# Altium schematic sheet 2025-07-26_00-47-341.schdoc
size 304 x 111 mm; SheetNumber: 1; SheetTotal: 1
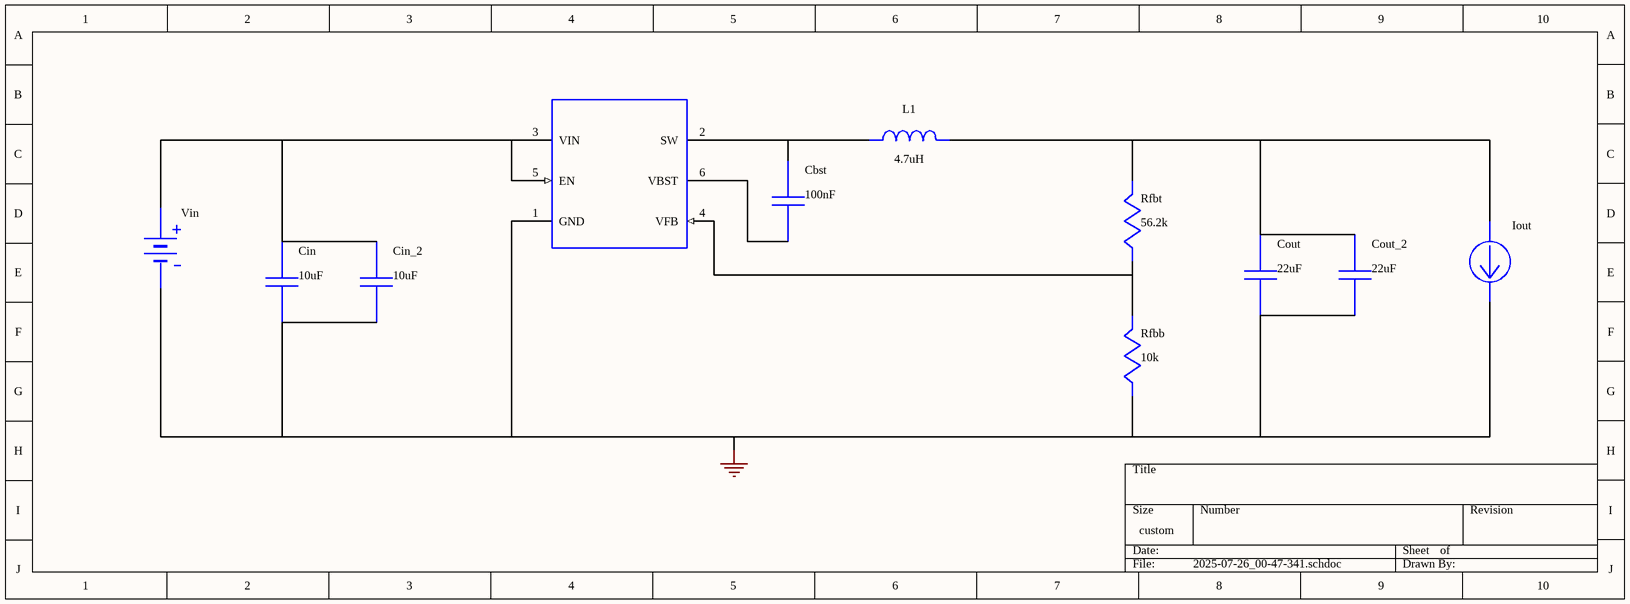
[diagram p0: 2025-07-26_00-47-341.schdoc]

## Parts
Cbst  value 100nF  (hidden comment: 08053C104KAT2A)
Cin  value 10uF  (hidden comment: MSAST219LB5106KTNA01)
Cin_2  value 10uF  (hidden comment: MSAST219LB5106KTNA01)
Cout  value 22uF  (hidden comment: C1608X5R1A226M080AC)
Cout_2  value 22uF  (hidden comment: C1608X5R1A226M080AC)
Iout  WB_CURRENT_LOAD  (value not drawn)
L1  value 4.7uH  (hidden comment: SRN6045-4R7Y)
Rfbb  value 10k  (hidden comment: RC0201FR-0710KL)
Rfbt  value 56.2k  (hidden comment: RC0201FR-0756K2L)
U1  TPS562200DDCR  (value not drawn)
Vin  WB_BATTERY  (value not drawn)

## Nets
0: Cin.2 Cin_2.2 Cout.2 Cout_2.2 Iout.2(-) Rfbb.2 U1.1(GND) Vin.2(-)
NetCbst_1: Cbst.1 L1.1 U1.2(SW)
NetCbst_2: Cbst.2 U1.6(VBST)
NetCin_1: Cin.1 Cin_2.1 U1.3(VIN) U1.5(EN) Vin.1(+)
NetCout_1: Cout.1 Cout_2.1 Iout.1(+) L1.2 Rfbt.1
NetRfbb_1: Rfbb.1 Rfbt.2 U1.4(VFB)

## Library data of the parts
Cbst = 08053C104KAT2A: Manufacturer Name: AVX; PackageReference: 08053C104KAT2A; Manufacturer Part Number: 08053C104KAT2A
Cin Cin_2 = MSAST219LB5106KTNA01: MSAST219LB5106KT; Manufacturer Name: Taiyo Yuden; PackageReference: MSAST219LB5106KTNA01; Manufacturer Part Number: MSAST219LB5106KTNA01
Cout Cout_2 = C1608X5R1A226M080AC: C1608X5R1A226M08; Manufacturer Name: TDK; PackageReference: C1608X5R1A226M080AC; Manufacturer Part Number: C1608X5R1A226M080AC
L1 = SRN6045-4R7Y: Manufacturer Name: Bourns; PackageReference: SRN6045-4R7Y; Manufacturer Part Number: SRN6045-4R7Y
Rfbb = RC0201FR-0710KL: Manufacturer Name: Yageo; PackageReference: RC0201FR-0710KL; Manufacturer Part Number: RC0201FR-0710KL
Rfbt = RC0201FR-0756K2L: Manufacturer Name: Yageo; PackageReference: RC0201FR-0756K2L; Manufacturer Part Number: RC0201FR-0756K2L
U1 = TPS562200DDCR: Manufacturer Name: Texas Instruments; PackageReference: Type; Manufacturer Part Number: TPS562200DDCR; Value: Value
Iout = WB_CURRENT_LOAD: PackageReference: WB_CURRENT_LOAD; Manufacturer Part Number: WB_CURRENT_LOAD; Manufacturer Name: WB_CURRENT_LOAD; Value: N/A
Vin = WB_BATTERY: PackageReference: WB_BATTERY; Manufacturer Part Number: WB_BATTERY; Manufacturer Name: WB_BATTERY; Value: N/A